# Altium schematic sheet Sheet1.SchDoc: Detector de Pico CSN
size A4; DrawnBy: RCP; Engineer: RCP; Organization: HGGM - LIM; Address1: RCP; DocumentNumber: 1; Revision: 1; SheetNumber: 1; SheetTotal: 1; PageSetup: Record=PageOptions|CenterHorizontal=True|CenterVertical=True|PrintScale=0.97|XCorrection=1.00|YCorrection=1.00|PrintKind=0|BorderSize=5000000|LeftOffset=0|BottomOffset=0|Orientation=2|PaperLength=1000|PaperWidth=1000|Scale=100|PaperSource=7|PrintQuality=-4|MediaType=1|DitherType=10|PaperKind=A4|PrintScaleMode=1
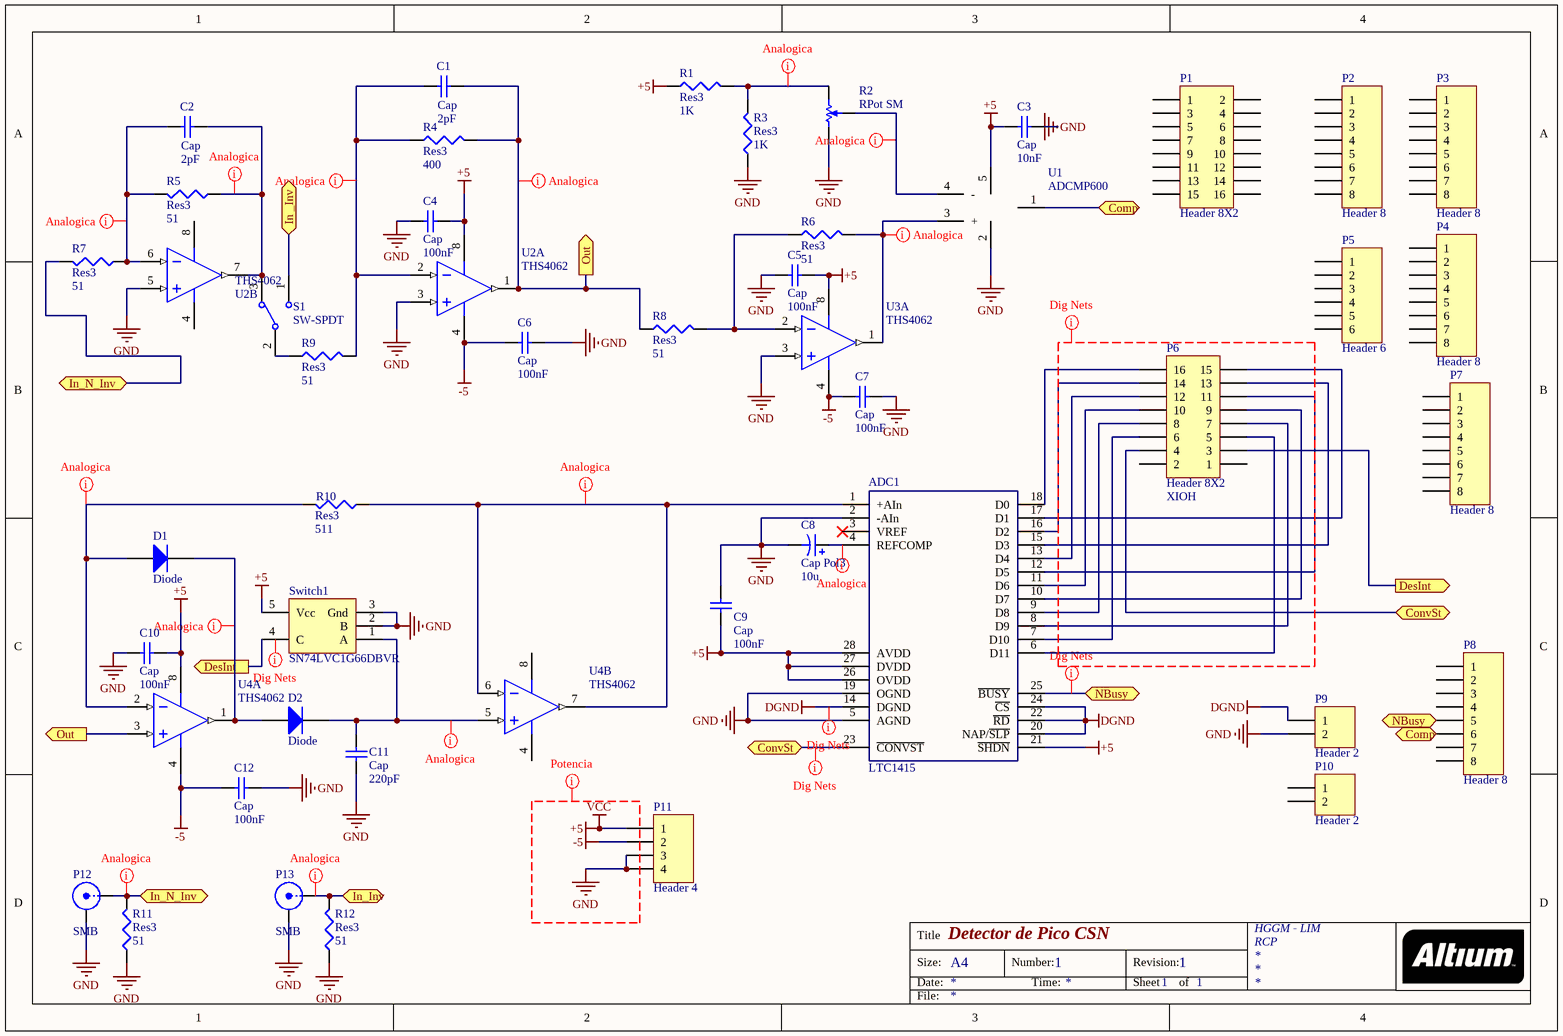
[diagram p0: Sheet1.SchDoc]

## Parts
ADC1  LTC1415  [SO28_N]
C1  Cap  value 2pF  [6-0805_N]
C2  Cap  value 2pF  [6-0805_N]
C3  Cap  value 10nF  [6-0805_N]
C4  Cap  value 100nF  [6-0805_N]
C5  Cap  value 100nF  [6-0805_N]
C6  Cap  value 100nF  [6-0805_N]
C7  Cap  value 100nF  [6-0805_N]
C8  Cap Pol3  value 10u  [C0805]
C9  Cap  value 100nF  [6-0805_N]
C10  Cap  value 100nF  [6-0805_N]
C11  Cap  value 220pF  [6-0805_N]
C12  Cap  value 100nF  [6-0805_N]
D1  Diode  [6-0805_N]
D2  Diode  [6-0805_N]
P1  Header 8X2  [HDR2X8]
P2  Header 8  [HDR1X8]
P3  Header 8  [HDR1X8]
P4  Header 8  [HDR1X8]
P5  Header 6  [HDR1X6]
P6  Header 8X2  Con_Arduino: XIOH  [HDR2X8]
P7  Header 8  [HDR1X8]
P8  Header 8  [HDR1X8]
P9  Header 2  [HDR1X2]
P10  Header 2  [HDR1X2]
P11  Header 4  [HDR1X4]
P12  SMB  [SMB_V-RJ45]
P13  SMB  [SMB_V-RJ45]
R1  Res3  value 1K  [6-0805_N]
R2  RPot SM  [POT4MM-2]
R3  Res3  value 1K  [6-0805_N]
R4  Res3  value 400  [6-0805_N]
R5  Res3  value 51  [6-0805_N]
R6  Res3  value 51  [6-0805_N]
R7  Res3  value 51  [6-0805_N]
R8  Res3  value 51  [6-0805_N]
R9  Res3  value 51  [6-0805_N]
R10  Res3  value 511  [6-0805_N]
R11  Res3  value 51  [6-0805_N]
R12  Res3  value 51  [6-0805_N]
S1  SW-SPDT  [HDR1X3]
Switch1  SN74LVC1G66DBVR  [SOT23-5_N]
U1  ADCMP600  [SOT23-5_N]
U2  THS4062  [S8_N]  (parts A,B of 2)
U3  THS4062  [S8_N]  (part A of 2)
U4  THS4062  [S8_N]  (parts A,B of 2)

## Ports
Comp, Comp (out), ConvSt, DesInt (out), In _Inv, In_Inv, In_N_Inv, NBusy, Out (out)

## Nets
+5: ADC1.21(~{SHDN}) ADC1.26(OVDD) ADC1.27(DVDD) ADC1.28(AVDD) C3.1 C4.2 C5.2 C9.1 C10.2 P11.1 R1.1 Switch1.5(Vcc) U1.5 U2.8(V+) U3.8(V+) U4.8(V+)  [also labelled VCC]
-5: C6.1 C7.1 C12.1 P11.2 U2.4(V-) U3.4(V-) U4.4(V-)
DGND: ADC1.14(DGND) ADC1.20(NAP/~{SLP}) ADC1.22(~{RD}) ADC1.24(~{CS}) P9.1
GND: ADC1.2(-AIn) ADC1.5(AGND) ADC1.19(OGND) C4.1 C5.1 C6.2 C7.2 C8.2 C9.2 C10.1 C11.1 C12.2 P9.2 P11.3 P11.4 P12.2(Y) P13.2(Y) R2.CCW(-) R3.1 R11.1 R12.1 Switch1.2(B) Switch1.3(Gnd) U1.2 U2.3(IN+) U2.5(IN+) U3.3(IN+)
Comp: P8.6 U1.1 ; port Comp
ConvSt: ADC1.23(~{CONVST}) P6.4 ; port ConvSt
DesInt: P6.3 Switch1.4(C) ; port DesInt
In _Inv: S1.1 ; port In _Inv
In_Inv: P13.1(X) R12.2 ; port In_Inv
In_N_Inv: P12.1(X) R7.2 R11.2 ; port In_N_Inv
NBusy: ADC1.25(~{BUSY}) P8.5 ; port NBusy
Out: C1.2 R4.2 R8.1 U2.1(OUT) U4.3(IN+) ; port Out
NetADC1_1: ADC1.1(+AIn) R10.1 U4.6(IN-) U4.7(OUT)
NetADC1_4: ADC1.4(REFCOMP) C8.1
NetADC1_6: ADC1.6(D11) P6.5
NetADC1_7: ADC1.7(D10) P6.6
NetADC1_8: ADC1.8(D9) P6.7
NetADC1_9: ADC1.9(D8) P6.8
NetADC1_10: ADC1.10(D7) P6.9
NetADC1_11: ADC1.11(D6) P6.10
NetADC1_12: ADC1.12(D5) P6.11
NetADC1_13: ADC1.13(D4) P6.12
NetADC1_15: ADC1.15(D3) P6.13
NetADC1_16: ADC1.16(D2) P6.14
NetADC1_17: ADC1.17(D1) P6.15
NetADC1_18: ADC1.18(D0) P6.16
NetC1_1: C1.1 R4.1 R9.2 U2.2(IN-)
NetC2_1: C2.1 R5.2 R7.1 U2.6(IN-)
NetC2_2: C2.2 R5.1 S1.3 U2.7(OUT)
NetC11_2: C11.2 D2.2(K) Switch1.1(A) U4.5(IN+)
NetD1_1: D1.1(A) R10.2 U4.2(IN-)
NetD1_2: D1.2(K) D2.1(A) U4.1(OUT)
NetR1_2: R1.2 R2.CW(+) R3.2
NetR2_W: R2.W U1.4(-)
NetR6_1: R6.1 R8.2 U3.2(IN-)
NetR6_2: R6.2 U1.3(+) U3.1(OUT)
NetR9_1: R9.1 S1.2

Not connected (* = marked no-connect by the designer): ADC1 3(VREF)*; C3 2; P1 1 2 3 4 5 6 7 8 9 10 11 12 13 14 15 16; P2 1 2 3 4 5 6 7 8; P3 1 2 3 4 5 6 7 8; P4 1 2 3 4 5 6 7 8; P5 1 2 3 4 5 6; P6 1 2; P7 1 2 3 4 5 6 7 8; P8 1 2 3 4 7 8; P10 1 2

## Layout directives
net class digital: (no net found under the mark), ConvSt, DGND, NBusy
net class potencia: +5, -5, GND, VCC
net class analog: In_Inv, In_N_Inv, NetADC1_1, NetADC1_4, NetC1_1, NetC2_1, NetC2_2, NetC11_2, NetD1_1, NetD1_2, NetR1_2, NetR2_W, NetR6_2, Out

## Notes on the sheet
- Labels drawn without touching a wire or pin: GND
- Title
- Size:
- Date:
- A4
- Number:
- Time:
- Revision:
- Sheet
- of
- File:

## Library data of the parts
C1-C7 C9-C12 = Cap: Capacitor; Published: 8-Jun-2000; LatestRevisionDate: 17-Jul-2002; LatestRevisionNote: Re-released for DXP Platform.; PackageReference: RAD-0.3; Publisher: Altium Limited; PackageDescription: Radial Cap, Thru-Hole; 2 Leads; 0.3 in Pin Spacing
C8 = Cap Pol3: Polarized Capacitor (Surface Mount); Published: 8-Jun-2000; LatestRevisionDate: 29-May-2009; LatestRevisionNote: IPC-7351 Footprint Added.; PackageReference: C0805; Publisher: Altium Limited; PackageDescription: Chip Capacitor
D1 D2 = Diode: Default Diode; Published: 8-Jun-2000; LatestRevisionDate: 17-Jul-2002; LatestRevisionNote: Re-released for DXP Platform.; PackageVersion: Sep-1996; PackageReference: SMC; Publisher: Altium Limited; PackageDescription: DO-214-AB/SMC; 2 C-Bend Leads; Body 7.9 x 5.9 mm, inc. leads (LxW); Code_JEDEC: DO-214-AB
P1 P6 = Header 8X2: Header, 8-Pin, Dual row; LatestRevisionDate: 17-Jul-2002; LatestRevisionNote: Re-released for DXP Platform.; Publisher: Altium Limited
P2-P4 P7 P8 = Header 8: Header, 8-Pin; LatestRevisionDate: 17-Jul-2002; LatestRevisionNote: Re-released for DXP Platform.; Publisher: Altium Limited
P5 = Header 6: Header, 6-Pin; LatestRevisionDate: 17-Jul-2002; LatestRevisionNote: Re-released for DXP Platform.; Publisher: Altium Limited
P9 P10 = Header 2: Header, 2-Pin; LatestRevisionDate: 17-Jul-2002; LatestRevisionNote: Re-released for DXP Platform.; Publisher: Altium Limited
P11 = Header 4: Header, 4-Pin; LatestRevisionDate: 17-Jul-2002; LatestRevisionNote: Re-released for DXP Platform.; Publisher: Altium Limited
P12 P13 = SMB: SMB Straight Connector; LatestRevisionDate: 17-Jul-2002; LatestRevisionNote: Re-released for DXP Platform.; Publisher: Altium Limited
R1 R3-R12 = Res3: Resistor; Published: 8-Jun-2000; LatestRevisionDate: 29-May-2009; LatestRevisionNote: IPC-7351 Footprint Added.; PackageReference: J1-0603; Publisher: Altium Limited; PackageDescription: Chip Resistor
R2 = RPot SM: Square Trimming Potentiometer; Published: 17-Dec-2003; DatasheetVersion: Oct-2003; PackageReference: POT4MM-2; Publisher: Altium Limited; PackageDescription: Square Trimming Potentiometer; ComponentLink1Description: Manufacturer Link; ComponentLink1URL: http://bourns.com/2/search.html
S1 = SW-SPDT: SPDT Subminiature Toggle Switch, Right Angle Mounting, Vertical Actuation; Published: 24-Mar-1999; LatestRevisionDate: 17-Dec-2003; LatestRevisionNote: Schematic revised, PCB Footprint replaced.; DatasheetVersion: 05-Dec-2000; PackageReference: TL36WW15050; Publisher: Altium Limited; PackageDescription: Switch; 4 Leads; ComponentLink1Description: Manufacturer Link; ComponentLink1URL: http://www.apem.com
U2-U4 = LT1253CS8: Low Cost Dual Video Amplifier; Note: 1003; Published: 8-Jun-2000; LatestRevisionDate: 13-Apr-2006; LatestRevisionNote: IPC-7351 Footprint Added.; DatasheetVersion: 1996; PackageReference: S8; Publisher: Altium Limited; PackageDescription: 8-Pin Small Outline Integrated Circuit 1.27 mm Pitch; Code_JEDEC: MS-012-AA; Code_IPC: SOIC127P600-8; ComponentLink1Description: Manufacturer Link; ComponentLink1URL: http://www.linear.com/; ComponentLink2Description: Datasheet; ComponentLink2URL: http://www.linear.com/pc/downloadDocument.do?navId=H0,C1,C1154,C1009,C1022,P1423,D1129